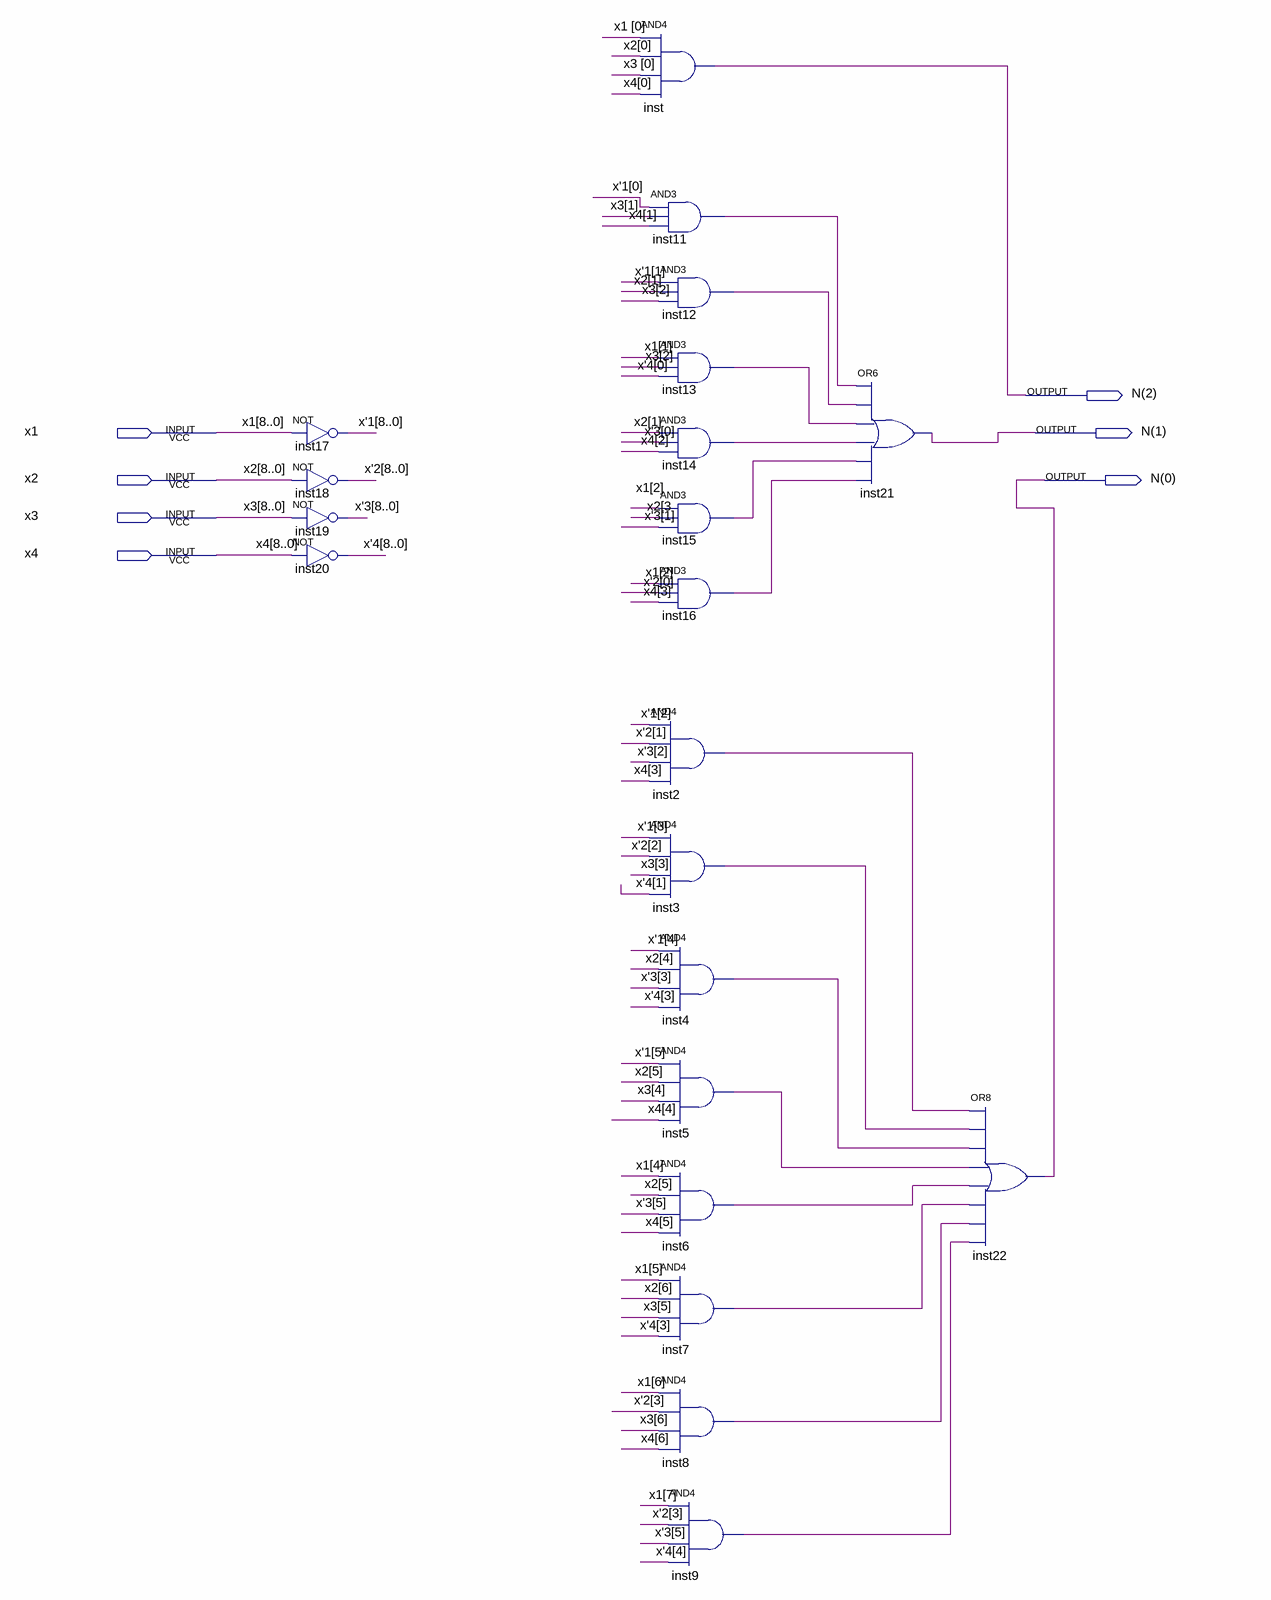
[diagram p0: schematic sheet]
// Quartus schematic g10_num1s_gates.bdf as structural Verilog: 21 symbols, 7 pins
module g10_num1s_gates (
  input  x1,
  input  x2,
  input  x3,
  input  x4,
  output \N(2) ,
  output \N(1) ,
  output \N(0) 
);

  wire inst2_out, inst3_out, inst4_out, inst5_out, inst6_out, inst7_out, inst8_out, inst9_out, inst11_out,
       inst12_out, inst13_out, inst14_out, inst15_out, inst16_out, \x2[3 ;
  wire [8:0] x1_bus, x2_bus, x3_bus, x4_bus, \x'1 , \x'2 , \x'3 , \x'4 ;

  assign \x'1  = ~x1_bus;  // NOT inst17, 9 bits wide
  assign \x'2  = ~x2_bus;  // NOT inst18, 9 bits wide
  assign \x'3  = ~x3_bus;  // NOT inst19, 9 bits wide
  assign \x'4  = ~x4_bus;  // NOT inst20, 9 bits wide
  and inst (\N(2) , x1_bus[0], x2_bus[0], x3_bus[0], x4_bus[0]);
  and inst11 (inst11_out, \x'1 [0], x3_bus[1], x4_bus[1]);
  and inst12 (inst12_out, \x'1 [1], x2_bus[1], x3_bus[2]);
  and inst13 (inst13_out, x1_bus[1], x3_bus[2], \x'4 [0]);
  and inst14 (inst14_out, x2_bus[1], \x'3 [0], x4_bus[2]);
  and inst15 (inst15_out, x1_bus[2], \x2[3 , \x'3 [1]);
  and inst16 (inst16_out, x1_bus[2], \x'2 [0], x4_bus[3]);
  and inst2 (inst2_out, \x'1 [2], \x'2 [1], \x'3 [2], x4_bus[3]);
  and inst3 (inst3_out, \x'1 [3], \x'2 [2], x3_bus[3], \x'4 [1]);
  and inst4 (inst4_out, \x'1 [4], x2_bus[4], \x'3 [3], \x'4 [3]);
  and inst5 (inst5_out, \x'1 [5], x2_bus[5], x3_bus[4], x4_bus[4]);
  and inst6 (inst6_out, x1_bus[4], x2_bus[5], \x'3 [5], x4_bus[5]);
  and inst7 (inst7_out, x1_bus[5], x2_bus[6], x3_bus[5], \x'4 [3]);
  and inst8 (inst8_out, x1_bus[6], \x'2 [3], x3_bus[6], x4_bus[6]);
  and inst9 (inst9_out, x1_bus[7], \x'2 [3], \x'3 [5], \x'4 [4]);
  or inst21 (\N(1) , inst11_out, inst12_out, inst13_out, inst14_out, inst15_out, inst16_out);
  or inst22 (\N(0) , inst2_out, inst3_out, inst4_out, inst5_out, inst6_out, inst7_out, inst8_out, inst9_out);
endmodule
